# Altium schematic sheet 2300_front.SchDoc: LTE2300 Frontend
size A4; ApprovedBy: ftg; Author: ftg; CompanyName: Bonk.Solutions; DrawnBy: ftg; Engineer: ftg; DocumentName: LTE2300 Frontend; ProjectName: HAMLTE
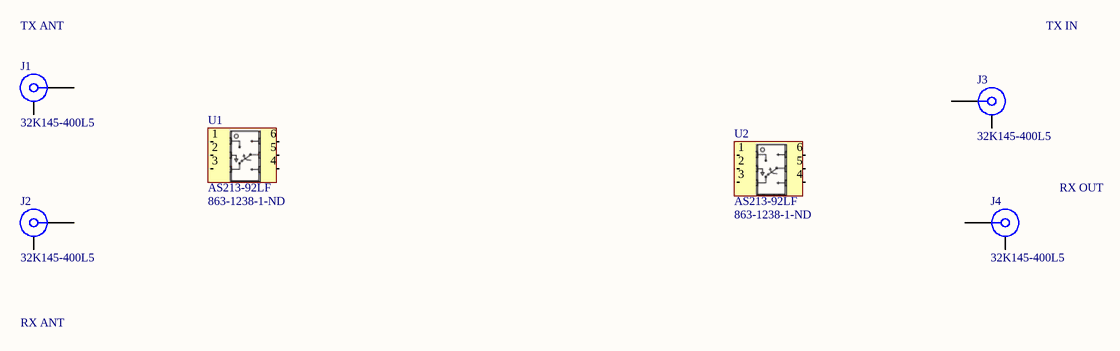
[diagram p0: 2300_front.SchDoc]

## Parts
J1  32K145-400L5  [ROS-32K145-400L5_V]
J2  32K145-400L5  [ROS-32K145-400L5_V]
J3  32K145-400L5  [ROS-32K145-400L5_V]
J4  32K145-400L5  [ROS-32K145-400L5_V]
U1  AS213-92LF  Supplier Part Number 1: 863-1238-1-ND  [SC70_6]
U2  AS213-92LF  Supplier Part Number 1: 863-1238-1-ND  [SC70_6]

## Nets

Not connected (* = marked no-connect by the designer): J1 1 MP; J2 1 MP; J3 1 MP; J4 1 MP; U1 1 2 3 4 5 6; U2 1 2 3 4 5 6

## Notes on the sheet
- TX ANT
- TX IN
- RX OUT
- RX ANT

## Library data of the parts
J1-J4 = 32K145-400L5: SMA Right Angle Jack, Edge Mount, Up to 18 GHz, -55 to 155 degC; Design Note 1: Footprint in library is a generic example - only application specific footprint delivers High Performance; Desgin Note 2: For more information about DRC setting, please look at following webpage, http://techdocs.altium.com/display/SCRT/Design+Rule+for+Edge-Mount+Connectors; DatasheetVersion: b00; PackageVersion: b00; PackageReference: 32K145-400L5; PackageDescription: SMA Right Angle Jack, Edge Mount, 14.25 x 9.5 x 4.46 mm; Mounting Technology: Surface Mount; PartNumber: 32K145-400L5; ComponentLink1Description: Manufacturer URL; ComponentLink1URL: http://www.rosenberger.de; ComponentLink2Description: Datasheet; ComponentLink2URL: http://rosenberger.de/ok/images/documents/db/32K145-400L5.pdf; ComponentLink3Description: Package Specification; ComponentLink3URL: http://rosenberger.de/ok/images/documents/db/32K145-400L5.pdf; ComponentLink4Description: Series Overview / Design Note; ComponentLink4URL: http://rosenberger.de/ok/images/documents/spez/32.pdf; ComponentLink5Description: Webshop / RFQ; ComponentLink5URL: http://www.rosenberger.com/en/contact/sales/
U1 U2 = AS213-92LF: Switch SPDT 0.1-3GHZ GAAS SC70-6; Manufacturer 1: Skyworks Solutions Inc.; Frequency - Lower: 100MHz; Frequency - Upper: 3GHz; Isolation @ Frequency: 19dB @ 3GHz (typ); Insertion Loss @ Frequency: 0.5dB @ 3GHz; IIP3: 40dBm (typ); Topology: Reflective; P1dB: 27dBm (typ) IP1dB; Impedance: 50 Ohm; Voltage - Supply: 3V; RF Type: Bluetooth, WLAN; Supplier 1: Digi-Key; Manufacturer Part Number 1: AS213-92LF; RoHS: RoHS Compliant; Category: RF/IF and RFID; Stock 1: 26253; Pricing 1: 1=0.41, 100=0.3393 (EUR); Packaging: Cut Tape (CT); Circuit: SPDT; Features: -; Operating Temperature: -40°C ~ 85°C; Package / Case: 6-TSSOP, SC-88, SOT-363; Supplier Device Package: SC-70-6; ComponentLink1URL: http://www.skyworksinc.com/uploads/documents/200193D.pdf; ComponentLink1Description: http://www.skyworksinc.com/uploads/documents/200193D.pdf